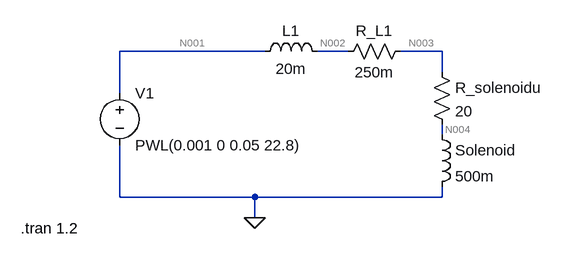
[diagram p0: schematic Elektrozaczep_z_cewka.asc]
Elektrozaczep_z_cewka.asc, the LTspice schematic file:
Version 4.1
SHEET 1 880 680
WIRE 176 128 -48 128
WIRE 304 128 256 128
WIRE 448 128 384 128
WIRE 448 160 448 128
WIRE -48 192 -48 128
WIRE 448 256 448 240
WIRE -48 352 -48 272
WIRE 160 352 -48 352
WIRE 448 352 448 336
WIRE 448 352 160 352
WIRE 160 384 160 352
FLAG 160 384 0
SYMBOL ind 160 144 R270
WINDOW 0 32 56 VTop 2
WINDOW 3 5 56 VBottom 2
SYMATTR InstName L1
SYMATTR Value 20m
SYMATTR SpiceLine Rser=0
SYMBOL voltage -48 176 R0
WINDOW 123 0 0 Left 0
WINDOW 39 0 0 Left 0
SYMATTR InstName V1
SYMATTR Value PWL(0.001 0 0.05 22.8)
SYMBOL res 432 144 R0
SYMATTR InstName R_solenoidu
SYMATTR Value 20
SYMBOL ind 432 240 R0
SYMATTR InstName Solenoid
SYMATTR Value 500m
SYMATTR SpiceLine Rser=0
SYMBOL res 288 144 R270
WINDOW 0 32 56 VTop 2
WINDOW 3 0 56 VBottom 2
SYMATTR InstName R_L1
SYMATTR Value 250m
TEXT -200 400 Left 2 !.tran 1.2

The netlist it stands for:
* Elektrozaczep_z_cewka.asc
L1 N001 N002 20m Rser=0
V1 N001 0 PWL(0.001 0 0.05 22.8)
R_solenoidu N003 N004 20
L§Solenoid N004 0 500m Rser=0
R_L1 N002 N003 250m
.tran 1.2
.backanno
.end

* Results of the author's LTspice run, read from the files saved beside the schematic
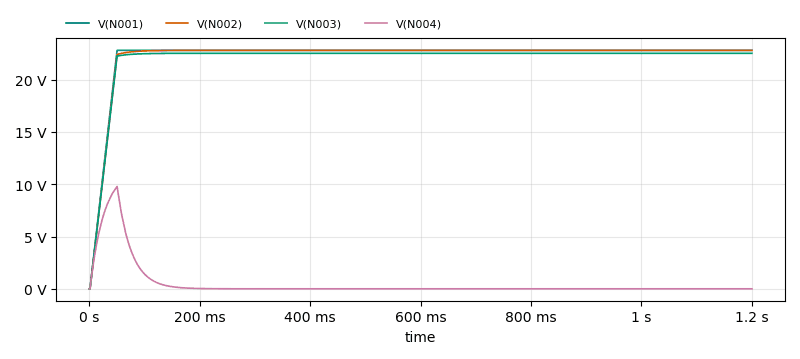
[diagram p1: Transient Analysis of Elektrozaczep_z_cewka.asc, plotted from the saved traces]
* Transient Analysis, 1 run:
*   V(N001): min 0 V, max 22.8 V, average 22.32 V, rms 22.48 V, last 22.8 V
*   V(N002): min 0 V, max 22.8 V, average 22.3 V, rms 22.46 V, last 22.8 V
*   V(N003): min 0 V, max 22.52 V, average 22.03 V, rms 22.19 V, last 22.52 V
*   V(N004): min -1.587 µV, max 9.785 V, average 469.7 mV, rms 1.733 V, last 0 V